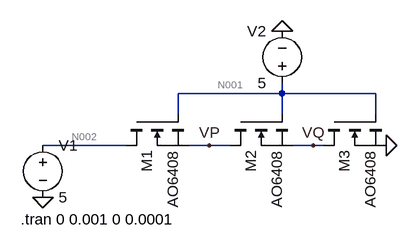
[diagram p0: schematic Draft3.asc]
Draft3.asc, the LTspice schematic file:
Version 4
SHEET 1 880 680
WIRE 128 48 128 32
WIRE 128 48 -32 48
WIRE 272 48 128 48
WIRE -32 80 -32 48
WIRE 128 80 128 48
WIRE 272 80 272 48
WIRE -112 128 -240 128
WIRE 16 128 -16 128
WIRE 48 128 16 128
WIRE 176 128 144 128
WIRE 192 128 176 128
FLAG 128 -48 0
FLAG -240 208 0
FLAG 16 128 VP
FLAG 176 128 VQ
FLAG 288 128 0
SYMBOL nmos -112 80 M90
SYMATTR InstName M1
SYMATTR Value AO6408
SYMBOL nmos 48 80 M90
SYMATTR InstName M2
SYMATTR Value AO6408
SYMBOL nmos 192 80 M90
SYMATTR InstName M3
SYMATTR Value AO6408
SYMBOL voltage -240 112 R0
WINDOW 123 0 0 Left 2
WINDOW 39 0 0 Left 2
SYMATTR InstName V1
SYMATTR Value 5
SYMBOL voltage 128 48 R180
WINDOW 0 24 96 Left 2
WINDOW 3 24 16 Left 2
WINDOW 123 0 0 Left 2
WINDOW 39 0 0 Left 2
SYMATTR InstName V2
SYMATTR Value 5
TEXT -274 242 Left 2 !.tran 0 0.001 0 0.0001

The netlist it stands for:
* Draft3.asc
M1 N002 N001 VP VP AO6408
M2 VP N001 VQ VQ AO6408
M3 VQ N001 0 0 AO6408
V1 N002 0 5
V2 N001 0 5
.model NMOS NMOS
.model PMOS PMOS
.lib standard.mos
.tran 0 0.001 0 0.0001
.backanno
.end

* Results of the author's LTspice run, read from the files saved beside the schematic
* Operating Point, zero values left out:
*   V(n002) = 5 V
*   V(n001) = 5 V
*   V(vp) = 2.246 V
*   V(vq) = 1.056 V
*   Id(M3) = 91.4 A
*   Is(M3) = -91.4 A
*   Id(M2) = 91.4 A
*   Is(M2) = -91.4 A
*   Id(M1) = 91.4 A
*   Is(M1) = -91.4 A
*   I(V1) = -91.4 A